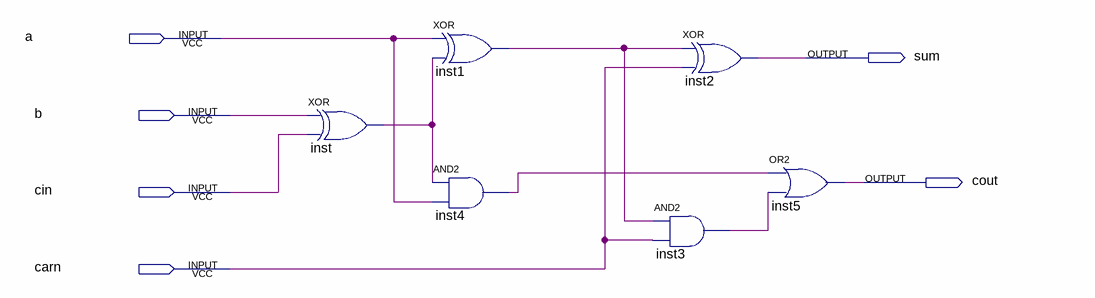
[diagram p0: schematic sheet]
// Quartus schematic fas.bdf as structural Verilog: 6 symbols, 6 pins
module fas (
  input  a,
  input  b,
  input  cin,
  input  carn,
  output sum,
  output cout
);

  wire inst1_out, inst3_out, inst4_out, inst_out;

  xor inst (inst_out, b, cin);
  xor inst1 (inst1_out, a, inst_out);
  and inst4 (inst4_out, inst_out, a);
  and inst3 (inst3_out, inst1_out, carn);
  xor inst2 (sum, inst1_out, carn);
  or inst5 (cout, inst4_out, inst3_out);
endmodule
